# EAGLE design Tic Tac PIC_688(e) (EAGLE 5.12)
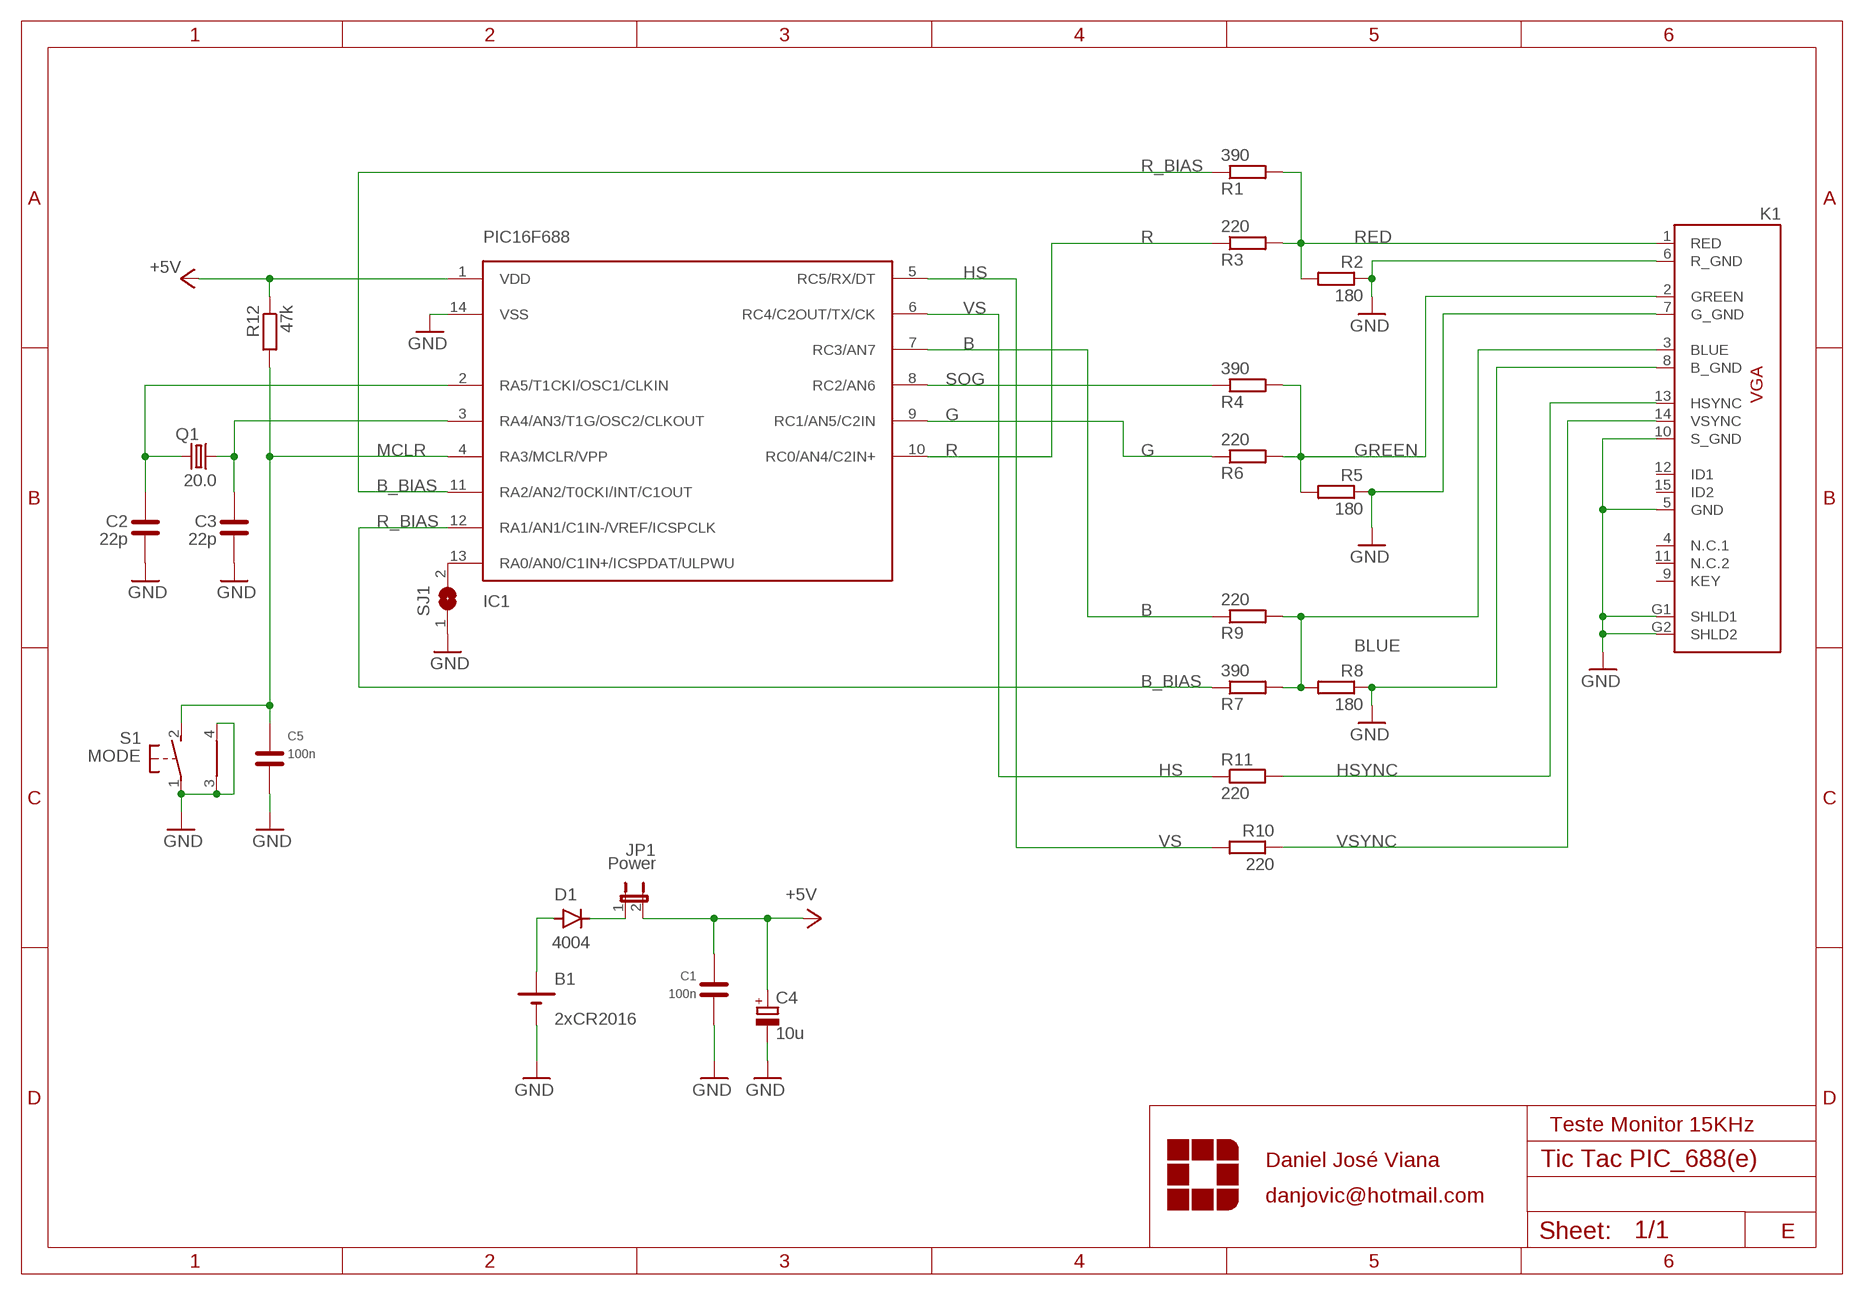
[diagram p0: schematic, sheet 1]

## Parts
B1  2xCR2016  CR2032H1GJ00245  [CR2032-1GJ00245]
C1  100n  CCERAMICO  [C050-024X044]
C2  22p  C  [C025-024X044]
C3  22p  C  [C025-024X044]
C4  10u  CPOL-EUE2-4_LARGEPADS  [E2-4_LARGEPADS]
C5  100n  CCERAMICO  [C050-024X044]
D1  4004  D200  [D200]
IC1  PIC16F688  [DIL14]
JP1  Power  JP1E  [JP1]
K1  CON_VGA_SH-  [HDF15H]
Q1  20.0  CRYSTALHC49S  [HC49/S]
R1  390  R-EU_0204/5A  [0204/5A]
R2  180  R-EU_0204/5A  [0204/5A]
R3  220  R-EU_0204/5A  [0204/5A]
R4  390  R-EU_0204/5A  [0204/5A]
R5  180  R-EU_0204/5A  [0204/5A]
R6  220  R-EU_0204/5A  [0204/5A]
R7  390  R-EU_0204/5A  [0204/5A]
R8  180  R-EU_0204/5A  [0204/5A]
R9  220  R-EU_0204/5A  [0204/5A]
R10  220  R-EU_0204/5A  [0204/5A]
R11  220  R-EU_0204/5A  [0204/5A]
R12  47k  R-EU_0204/5A  [0204/5A]
S1  MODE  31-XX  [B3F-31XX]
SJ1  SJ  [SJ]

## Nets
+5V: C1.2 C4.+ IC1.1(VDD) JP1.2 R12.1
B: IC1.7(RC3/AN7) R9.1
B_BIAS: IC1.12(RA1/AN1/C1IN-/VREF/ICSPCLK) R7.1
BLUE: K1.3(BLUE) R7.2 R8.2 R9.2
G: IC1.9(RC1/AN5/C2IN) R6.1
GND: B1.MINUS C1.1 C2.1 C3.1 C4.- C5.1 IC1.14(VSS) K1.5(GND) K1.6(R_GND) K1.7(G_GND) K1.8(B_GND) K1.10(S_GND) K1.G1(SHLD1) K1.G2(SHLD2) R2.1 R5.1 R8.1 S1.1(P) S1.3(SH1) S1.4(SH2) SJ1.1
GREEN: K1.2(GREEN) R4.2 R5.2 R6.2
HS: IC1.6(RC4/C2OUT/TX/CK) R11.1
HSYNC: K1.13(HSYNC) R11.2
MCLR: C5.2 IC1.4(RA3/MCLR/VPP) R12.2 S1.2(S)
N$1: IC1.13(RA0/AN0/C1IN+/ICSPDAT/ULPWU) SJ1.2
N$3: D1.K JP1.1
R: IC1.10(RC0/AN4/C2IN+) R3.1
R_BIAS: IC1.11(RA2/AN2/T0CKI/INT/C1OUT) R1.1
RED: K1.1(RED) R1.2 R2.2 R3.2
SOG: IC1.8(RC2/AN6) R4.1
VBAT: B1.PLUS D1.A
VS: IC1.5(RC5/RX/DT) R10.2
VSYNC: K1.14(VSYNC) R10.1
X1: C3.2 IC1.3(RA4/AN3/T1G/OSC2/CLKOUT) Q1.1
X2: C2.2 IC1.2(RA5/T1CKI/OSC1/CLKIN) Q1.2
Unconnected: K1.4(N.C.1) K1.9(KEY) K1.11(N.C.2) K1.12(ID1) K1.15(ID2)

## Notes on the sheet
- Teste Monitor 15KHz
- Daniel José Viana
- danjovic@hotmail.com
- E

## Library data of the parts
B1 = diversos2:CR2032H: LI BATTERY Varta
C1-C3 C5 = diversos2:C*
C4 = rcl:CPOL-EU: POLARIZED CAPACITOR, European symbol
D1 = diversos2:D*: Diodo
IC1 = Microchip PIC:PIC16F688
JP1 = jumper:JP1E: JUMPER
K1 = diversos2:CON_VGA_SH-: SUB D, 15 positions, high density
Q1 = diversos2:CRYSTAL: CRYSTAL; OC_FARNELL: 1667008; OC_NEWARK: unknown
R1-R12 = rcl:R-EU_: RESISTOR, European symbol
S1 = diversos2:31-XX: OMRON SWITCH; MPN: B3F-3100; OC_FARNELL: 959704; OC_NEWARK: 36M3582
SJ1 = jumper:SJ: SMD solder JUMPER

## Board
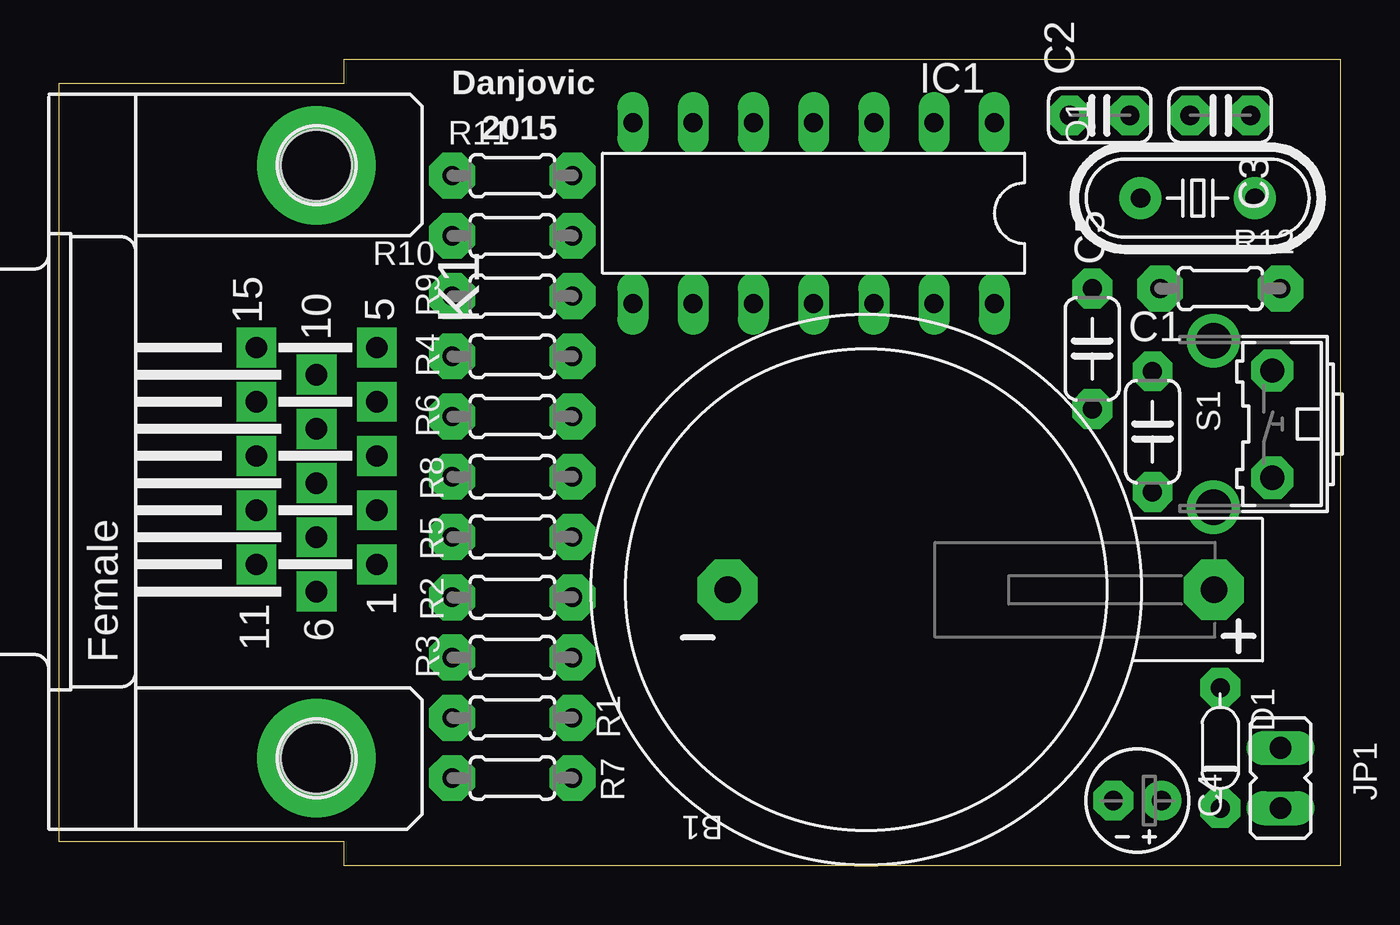
[diagram p1: board, top side]
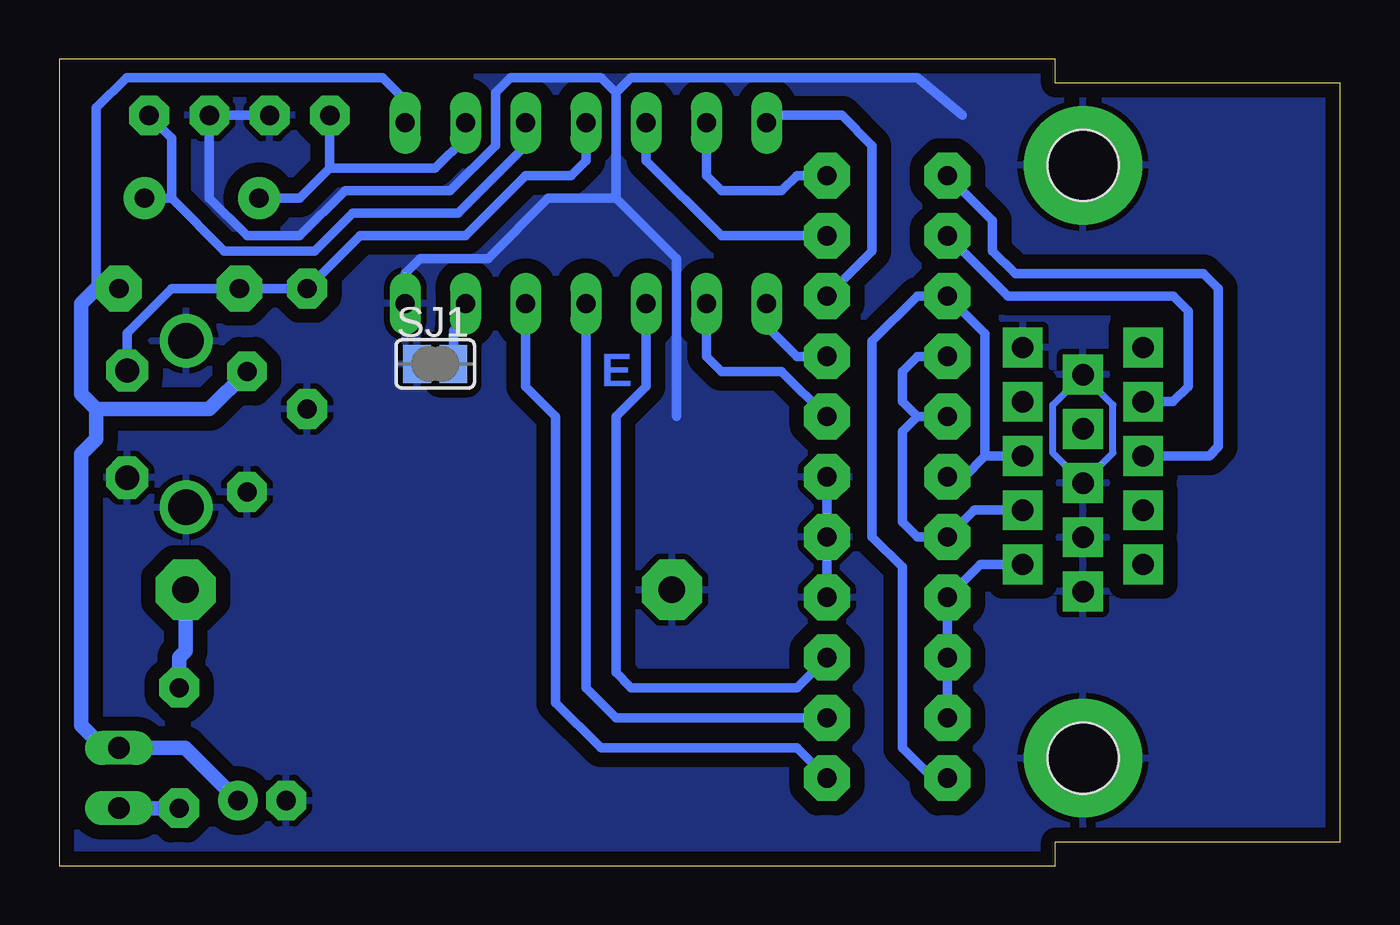
[diagram p2: board, bottom side, seen from below]

Size 54 x 34 mm. Coordinates in mm from the lower left corner, seen from the top.
Copper layers (1*16): Top 0.035mm / dielectric 1.5mm / Bottom 0.035mm
Design rules "default *": minimum track width 10mil, minimum drill 24mil, track to track 8mil, track to pad 8mil, pad to pad 8mil, via to via 8mil, smd to smd 8mil, copper to edge 20mil, drill to drill 8mil, minimum pad ring 10mil, minimum via ring 8mil, stop-mask expansion 4mil, vias tented up to drill 0mil, thermal gap 10mil

### Footprints (pad centres in the part's own frame; a part is rotated, then mirrored left to right if it is on the bottom)
CR2032-1GJ00245 = drill 1.118 pad 2.54 octagon: MINUS 5.85,0; PLUS -14.65,0
C050-024X044 = drill 0.8 pad 1.676 octagon: 1 -2.54,0; 2 2.54,0
C025-024X044 = drill 0.813 pad 1.676 octagon: 1 -1.27,0; 2 1.27,0
E2-4_LARGEPADS = drill 0.813 pad 1.676 round: + -1.016,0 | drill 0.813 pad 1.676 octagon: - 1.016,0
D200 = drill 0.8 pad 1.676 octagon: A -2.54,0; K 2.54,0
DIL14 = drill 0.8 long: 1 -3.81,3.81; 2 -3.81,1.27; 3 -3.81,-1.27; 4 -3.81,-3.81; 5 -3.81,-6.35; 6 -3.81,-8.89; 7 -3.81,-11.43; 8 3.81,-11.43; 9 3.81,-8.89; 10 3.81,-6.35; 11 3.81,-3.81; 12 3.81,-1.27; 13 3.81,1.27; 14 3.81,3.81
JP1 = drill 0.914 long: 1 0,-1.27; 2 0,1.27
HDF15H = drill 0.9 pad 1.676 square: 1 4.329,2.54; 2 2.043,2.54; 3 -0.243,2.54; 4 -2.529,2.54; 5 -4.815,2.54; 6 5.472,0; 7 3.186,0; 8 0.9,0; 9 -1.386,0; 10 -3.672,0; 11 4.329,-2.54; 12 2.043,-2.54; 13 -0.243,-2.54; 14 -2.529,-2.54; 15 -4.815,-2.54 | drill 3 pad 5 round: G1 -12.5,0; G2 12.5,0 | hole 3: -12.5,0; 12.5,0
HC49/S = drill 0.813 pad 1.778 round: 1 -2.413,0; 2 2.413,0
0204/5A = drill 0.813 pad 1.93 octagon: 1 -2.54,0; 2 2.54,0
B3F-31XX = drill 1.016 pad 1.778 octagon: 1 -2.261,-1.245; 2 2.261,-1.245 | drill 1.499 pad 2.159 round: 3 -3.505,1.245; 4 3.505,1.245
SJ = smd 1.168 x 1.6: 1 -0.762,0; 2 0.762,0

### Placement (x,y rotation side)
B1  34.02,11.63 180 top
C1  46.09,18.3 90 top
C2  43.87,31.63 180 top
C3  48.95,31.63 0 top
C4  45.45,2.74 180 top
C5  43.55,21.79 90 top
D1  48.95,4.96 270 top
IC1  35.61,27.51 270 top
JP1  51.48,3.69 0 top
K1  10.84,17.03 270 top
Q1  47.99,28.14 180 top
R1  19.1,6.23 180 top
R2  19.1,11.31 180 top
R3  19.1,8.77 180 top
R4  19.1,21.47 180 top
R5  19.1,13.85 180 top
R6  19.1,18.93 180 top
R7  19.1,3.69 180 top
R8  19.1,16.39 180 top
R9  19.1,24.02 180 top
R10  19.1,26.55 0 top
R11  19.1,29.09 180 top
R12  48.95,24.33 180 top
S1  49.9,18.62 90 top
SJ1  38.15,21.16 0 bottom
U$1  [TIC_TAC_INSET]  0,17 0 top

### Tracks (layer width: path | path; a pad name or v marks a point on that pad's centre or on a via)
+5V
  Bottom 0.406: IC1.1 39.42,32.27 40.37,33.22 51.17,33.22 52.44,31.95 52.44,24.33 R12.1
  Bottom 0.61: 52.44,24.33 53.07,23.7 53.07,19.89 52.44,19.25 | 52.44,19.25 47.68,19.25 C1.2 | 52.44,19.25 52.44,17.98 53.07,17.35 53.07,5.92 52.12,4.96 JP1.2 48.69,4.96 C4.+
B
  Bottom 0.406: R9.1 19.73,25.92 19.73,30.36 21.01,31.63 23.55,31.63 IC1.7
B_BIAS
  Bottom 0.406: R7.1 22.91,4.96 31.16,4.96 33.07,6.87 33.07,18.93 34.34,20.2 IC1.12
BLUE
  Bottom 0.406: R7.2 17.2,3.69 18.46,4.96 18.46,12.59 19.73,13.85 19.73,22.11 17.83,24.02 R9.2 14.97,22.43 14.97,17.27 | 14.97,17.27 K1.3 | R8.2 15.85,16.39 14.97,17.27
G
  Bottom 0.406: R6.1 23.55,20.84 26.09,20.84 26.72,21.47 IC1.9
GND
  Bottom 0.305: K1.8 12.11,17.4 12.11,19.43 K1.10 9.57,19.43 9.57,17.4 K1.8
  Bottom 0.406: R2.1 R5.1 R8.1 | C2.1 C3.1 47.68,28.14 46.09,26.55 43.87,26.55 41.96,28.46 37.52,28.46 35.61,30.36 35.61,32.59 34.98,33.22 31.16,33.22 30.53,32.59 | 30.53,32.59 29.89,33.22 17.83,33.22 15.92,31.63 | IC1.14 39.42,24.97 38.78,25.6 35.93,25.6 33.39,28.14 30.53,28.14 | 30.53,28.14 30.53,32.59 | 30.53,28.14 27.99,25.6 27.99,18.93
  pour Bottom (isolate 0.61): -0.59,34.17 0.05,-0.12 54.66,-0.12 54.66,34.17
GREEN
  Bottom 0.406: K1.2 15.43,14.99 R5.2 17.83,13.85 18.46,14.49 18.46,18.3 17.83,18.93 | R4.2 17.83,21.47 18.46,20.84 18.46,19.57 17.83,18.93 | 17.83,18.93 R6.2
HS
  Bottom 0.406: R11.1 22.91,29.09 23.55,28.46 26.09,28.46 26.72,29.09 IC1.6
HSYNC
  Bottom 0.406: K1.13 5.52,17.27 5.13,17.66 5.13,24.33 5.77,24.97 13.7,24.97 14.65,25.92 14.65,27.19 R11.2
MCLR
  Bottom 0.406: S1.2 51.14,22.45 49.26,24.33 R12.2 C5.2 41.32,26.55 36.88,26.55 34.34,29.09 32.44,29.09 31.8,29.73 IC1.4
N$1
  Bottom 0.406: IC1.13 36.88,23.06 37.39,22.55 SJ1.2
N$3
  Bottom 0.61: D1.K JP1.1
R
  Bottom 0.406: R3.1 22.91,7.5 29.89,7.5 30.53,8.14 30.53,18.93 29.26,20.2 IC1.10
R_BIAS
  Bottom 0.406: IC1.11 31.8,7.5 30.53,6.23 R1.1
RED
  Bottom 0.406: K1.1 15.17,12.7 R2.2 R3.2 R1.2
SOG
  Bottom 0.406: R4.1 22.91,21.47 24.18,22.74 IC1.8
TITLE
  pour Bottom: 43.55,4.01 43.55,16.71 42.59,17.66 34.34,17.66 34.34,2.74 42.28,2.74
VBAT
  Bottom 0.61: B1.PLUS 48.67,9.05 48.95,8.77 D1.A
VS
  Bottom 0.406: IC1.5 29.26,29.73 26.09,26.55 R10.2
VSYNC
  Bottom 0.406: K1.14 7.05,19.56 6.4,20.2 6.4,23.38 7.04,24.02 14.02,24.02 R10.1
X1
  Bottom 0.406: IC1.3 34.34,30.36 37.2,27.51 41.64,27.51 43.23,25.92 47.04,25.92 49.26,28.14 | 49.26,28.14 49.26,30.68 C3.2 | 49.26,28.14 Q1.1
X2
  Bottom 0.406: IC1.2 36.88,30.68 38.15,29.41 42.59,29.41 | 42.59,29.41 C2.2 | Q1.2 43.87,28.14 42.59,29.41

### Text on the board
Bottom: E
tPlace: Danjovic | 2015
bRestrict: 2015 | Danjovic | TicTac X